# EasyEDA Pro project dub_siren_board.epro

# Schematic Schematic1
Board Name: master; Create Date: 2025-08-04; Page Name: P1; Project Name: dubsiren; Schematic Name: Schematic1; Update Date: 2025-09-22; Company: EasyEDA.com; Page Size: A4; Version: V1.0
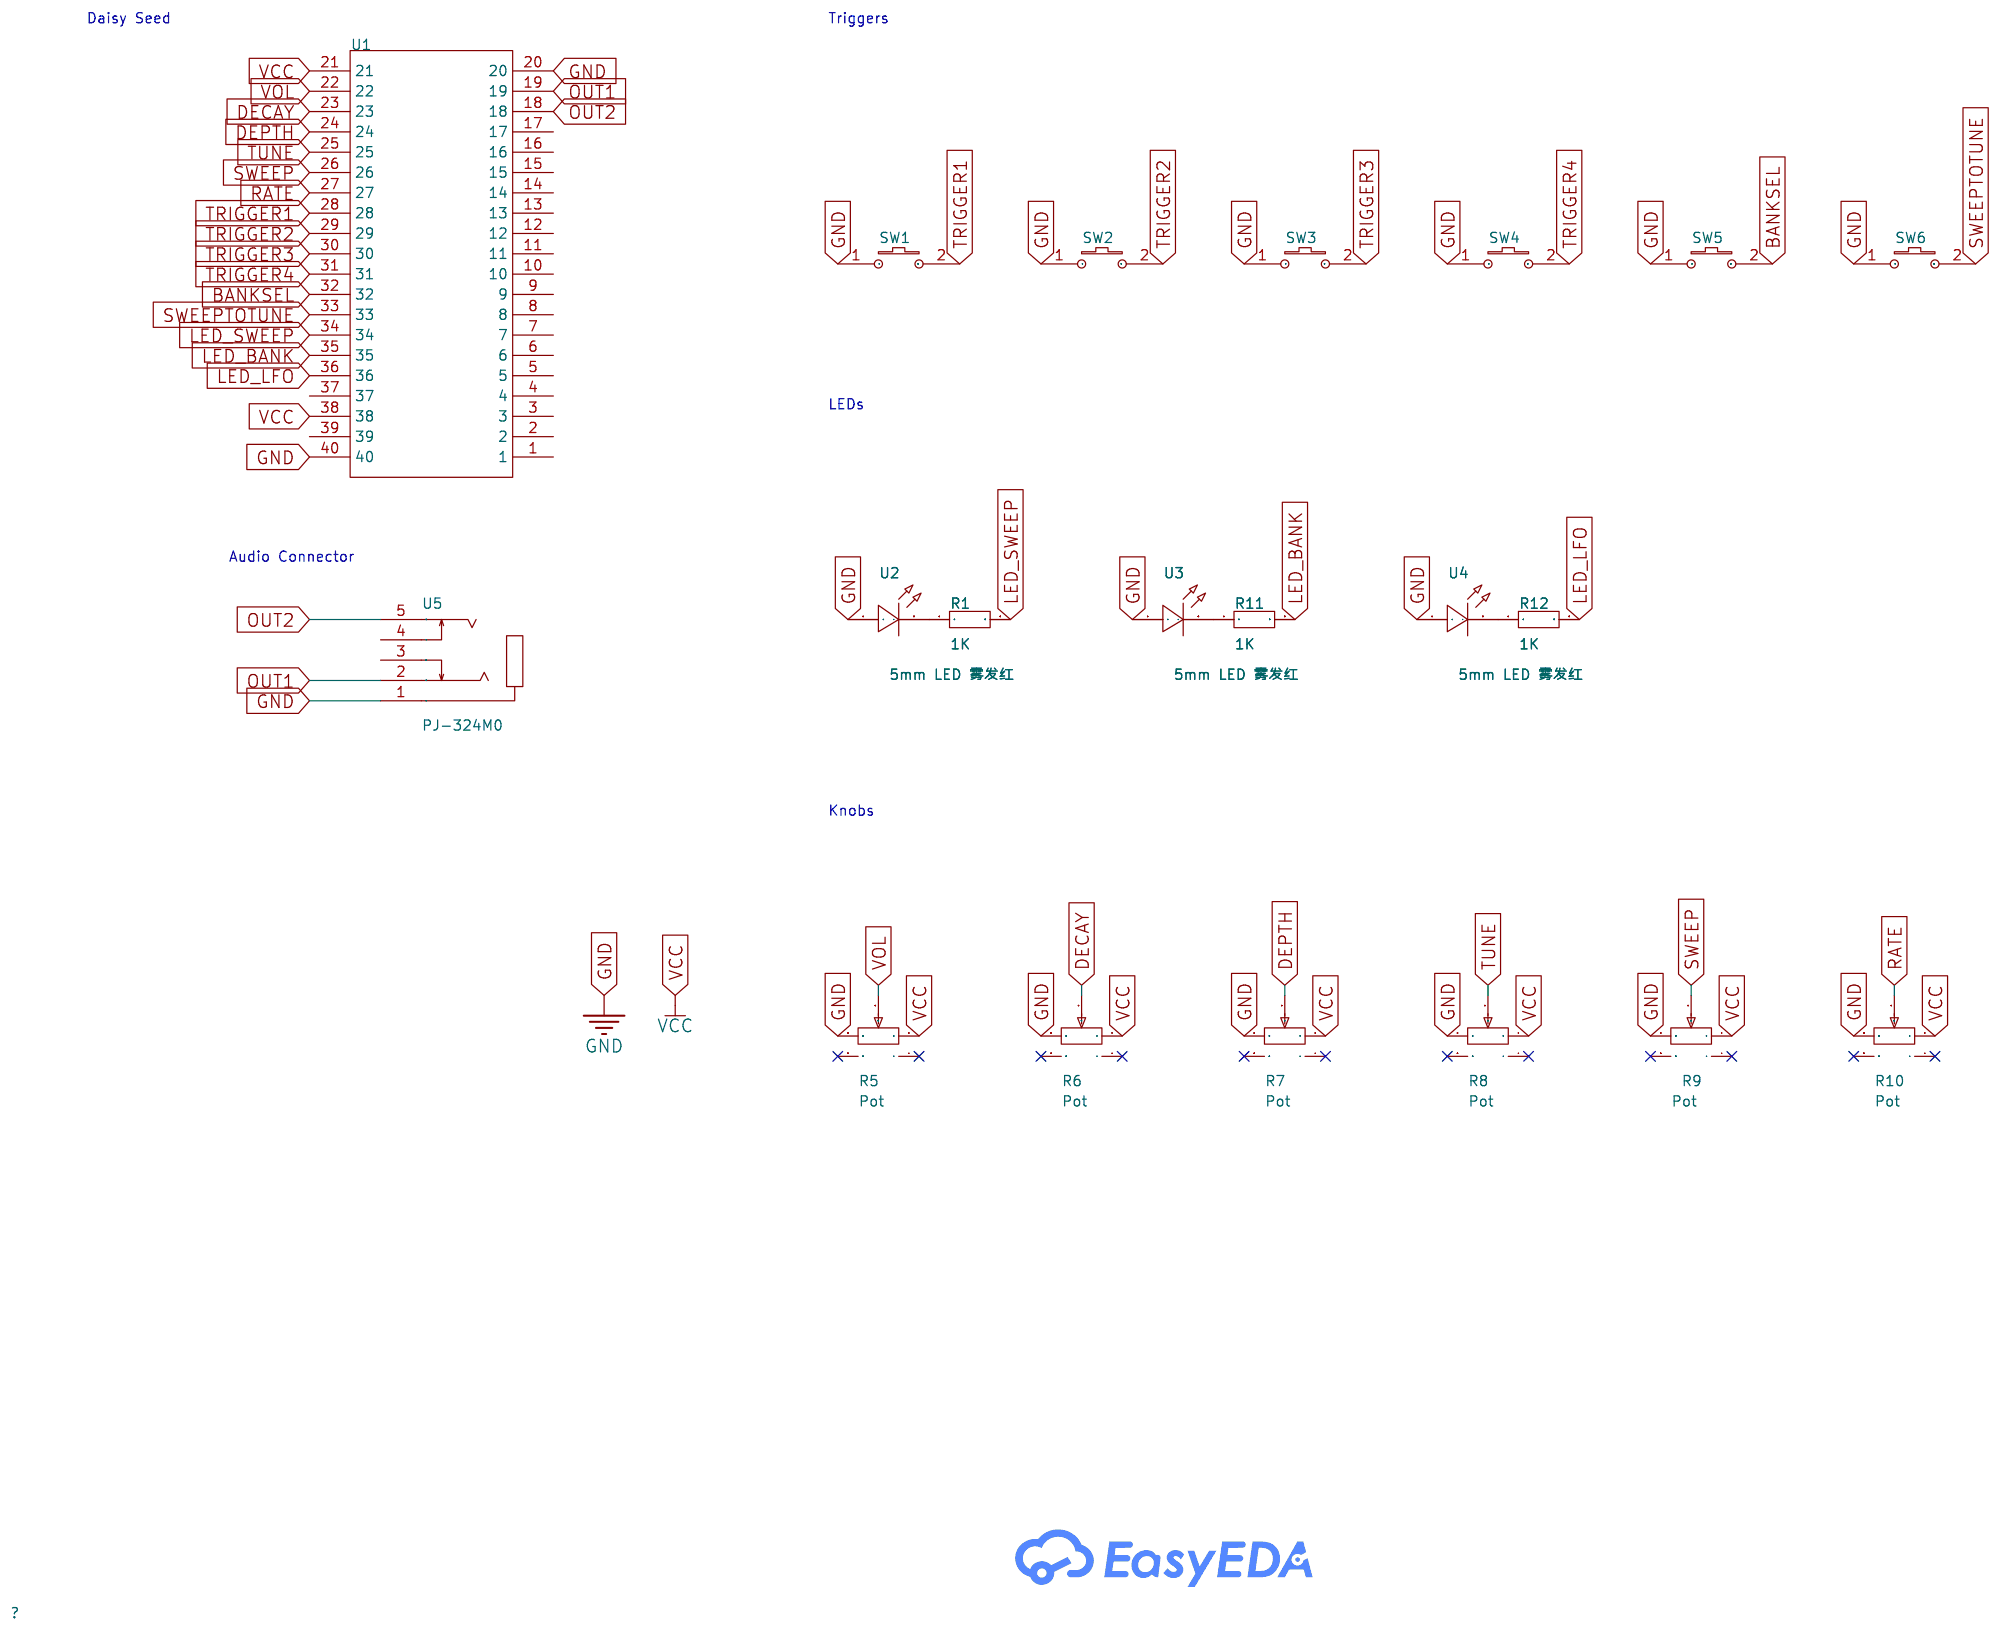
[diagram p0: schematic sheet]

## Parts
R1  1K  [R0603]
R5  Pot  [RES-ADJ-TH_RV09]
R6  Pot  [RES-ADJ-TH_RV09]
R7  Pot  [RES-ADJ-TH_RV09]
R8  Pot  [RES-ADJ-TH_RV09]
R9  Pot  [RES-ADJ-TH_RV09]
R10  Pot  [RES-ADJ-TH_RV09]
R11  1K  [R0603]
R12  1K  [R0603]
SW1  -  [SWITCH CHERRY MX]
SW2  -  [SWITCH CHERRY MX]
SW3  -  [SWITCH CHERRY MX]
SW4  -  [SWITCH CHERRY MX]
SW5  -  [SWITCH CHERRY MX]
SW6  -  [SWITCH CHERRY MX]
U1  -  [40 PinSocket]
U2  5mm LED 雾发红  [LED-TH_BD5.0-P2.54-FD]
U3  5mm LED 雾发红  [LED-TH_BD5.0-P2.54-FD]
U4  5mm LED 雾发红  [LED-TH_BD5.0-P2.54-FD]
U5  PJ-324M0  [AUDIO-TH_PJ-324-M]

## Library data of the parts
R1 R11 R12 = Res_0603: Supplier Footprint: 0603
R5-R10 = RV09AF-40-15K-B10K-0C: Supplier Part: C5151446; Supplier Footprint: 插件; JLCPCB Part Class: Extended Part; Supplier: LCSC
SW1-SW6 = Switch Cherry MX: Manufacturer: ZF; Manufacturer Part: MX1A-11NW; Supplier: RS-Online; Supplier Part: 664-575A
U1 = 40 PinSocket
U2-U4 = 5mm LED 雾发红: Supplier Part: C9900034380; Supplier Footprint: LED 5MM; JLCPCB Part Class: Extended Part; Supplier: LCSC
U5 = PJ-324M0: Connector Type:3.5mm Headphone Jack Current Rating:500mA Voltage Rating (Max):30V Operating Temperature:-20℃~+70℃ Operating Temperature:-20℃~+70℃; LCSC Part Name: 两件套 3.5mm耳机座; Supplier Part: C2884986; Manufacturer: XKB Connection(中国星坤); Supplier Footprint: 插件; JLCPCB Part Class: Extended Part; Datasheet: https://atta.szlcsc.com/upload/public/pdf/source/20211011/590F5910DCF166B8267C523E23F455F0.pdf; Supplier: LCSC; Connector Type: 3.5mm Headphone Jack; Current Rating: 500mA; Voltage Rating (Max): 30V; Operating Temperature: -20℃~+70℃

## Nets
GND: R5.3 R6.3 R7.3 R8.3 R9.3 R10.3 SW1.1 SW2.1 SW3.1 SW4.1 SW5.1 SW6.1 U1.20 U1.40 U2.1(+) U3.1(+) U4.1(+) U5.1
VCC: R5.1 R6.1 R7.1 R8.1 R9.1 R10.1 U1.21 U1.38
BANKSEL: SW5.2 U1.32
DECAY: R6.2 U1.23
DEPTH: R7.2 U1.24
LED_BANK: R11.2 U1.35
LED_LFO: R12.2 U1.36
LED_SWEEP: R1.2 U1.34
OUT1: U1.19 U5.2
OUT2: U1.18 U5.5
RATE: R10.2 U1.27
SWEEP: R9.2 U1.26
SWEEPTOTUNE: SW6.2 U1.33
TRIGGER1: SW1.2 U1.28
TRIGGER2: SW2.2 U1.29
TRIGGER3: SW3.2 U1.30
TRIGGER4: SW4.2 U1.31
TUNE: R8.2 U1.25
VOL: R5.2 U1.22
$1N1751: R1.1 U2.2(-)
$1N1843: R11.1 U3.2(-)
$1N1932: R12.1 U4.2(-)

Not connected (* = marked no-connect by the designer): R5 4* 5*; R6 4* 5*; R7 4* 5*; R8 4* 5*; R9 4* 5*; R10 4* 5*; U1 1 2 3 4 5 6 7 8 9 10 11 12 13 14 15 16 17 37 39; U5 3 4

## Notes on the sheet
- Daisy Seed
- Triggers
- LEDs
- Audio Connector
- Knobs

# Board PCB1
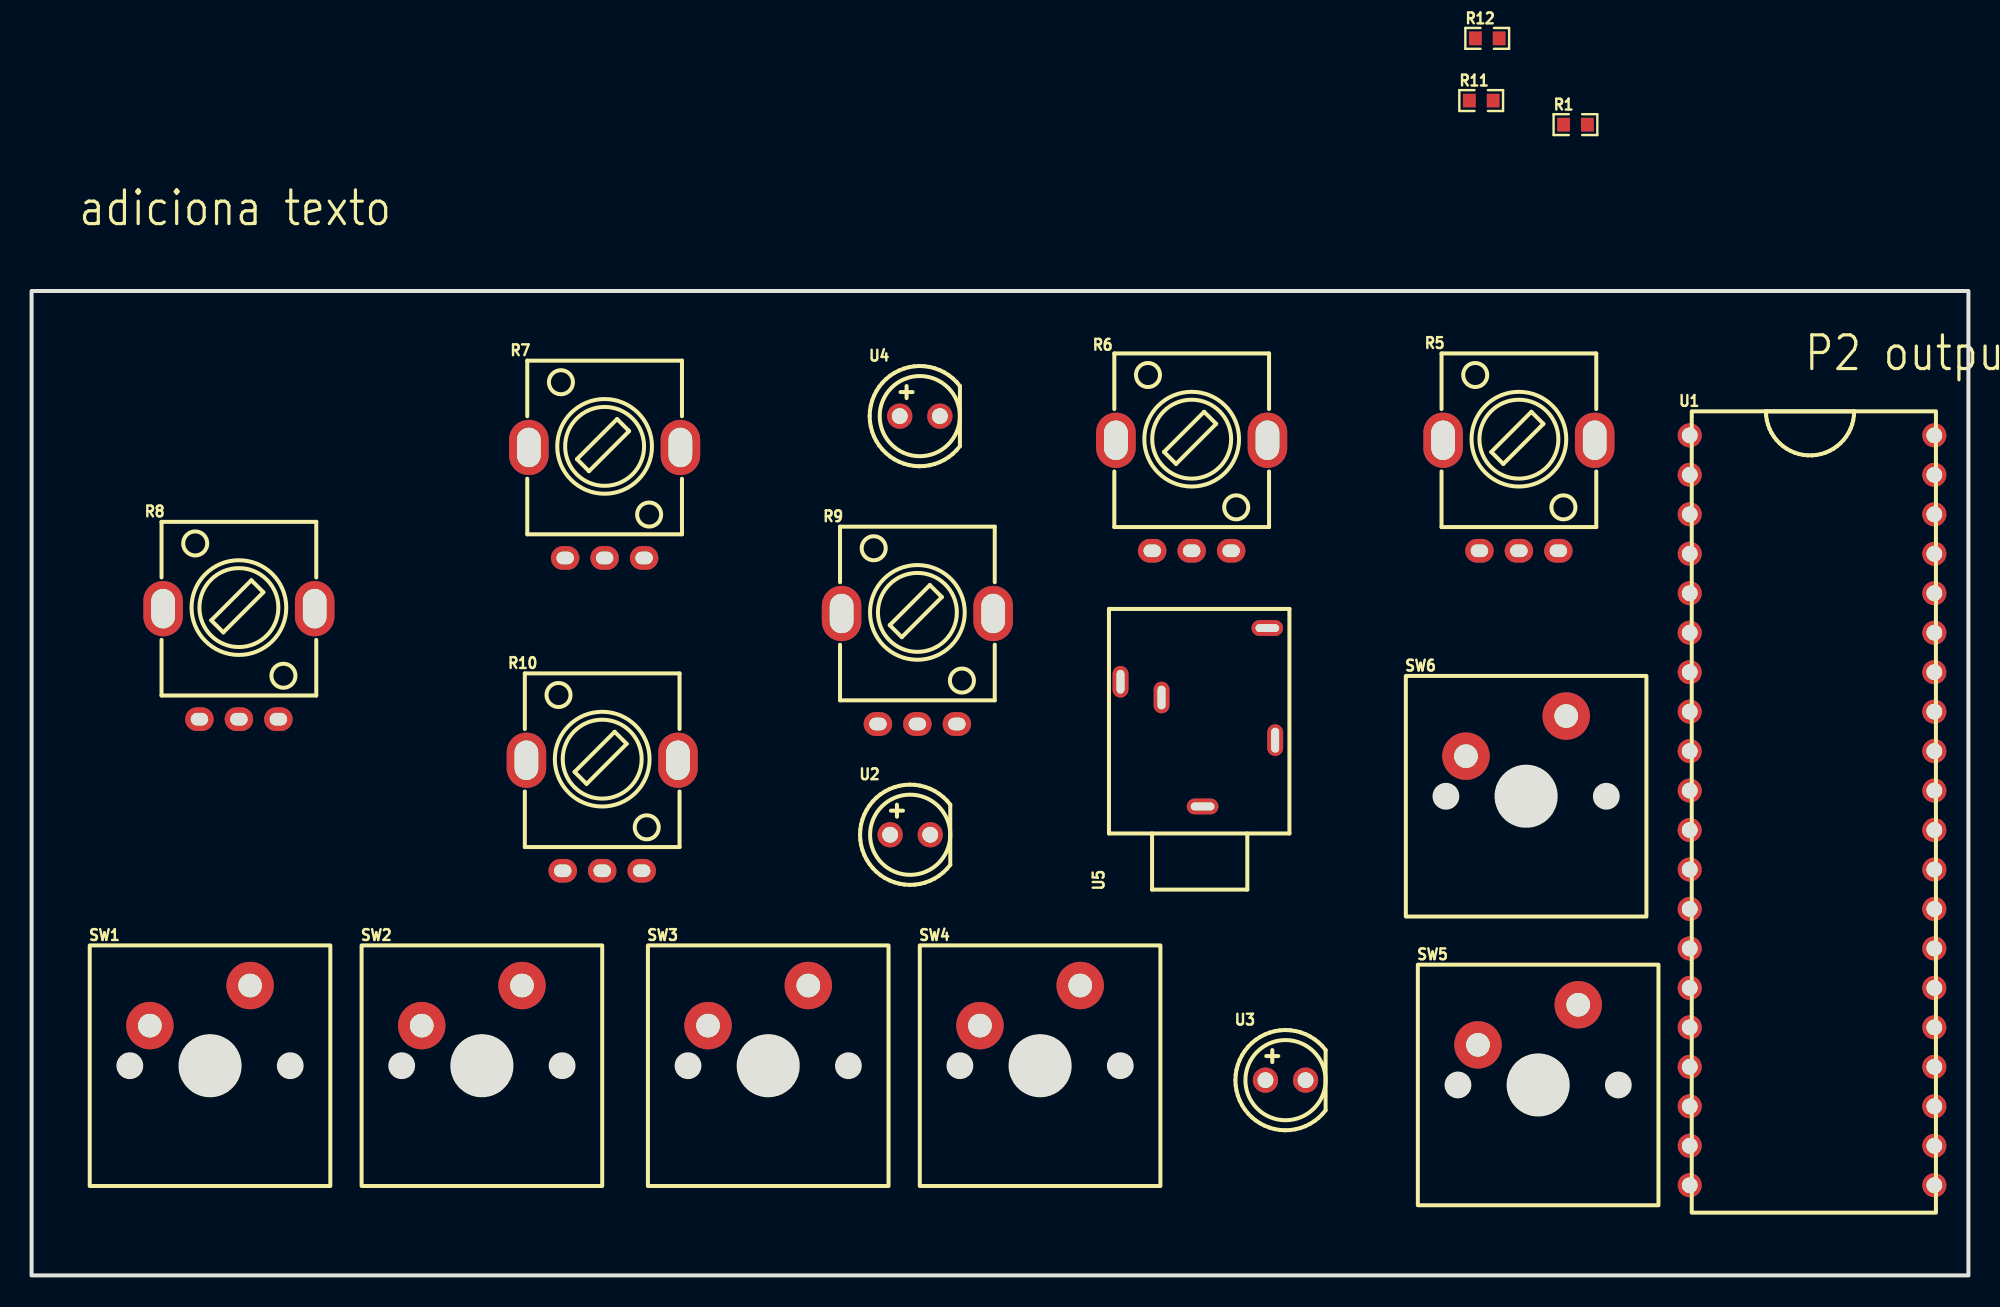
[diagram p1: board, top side]
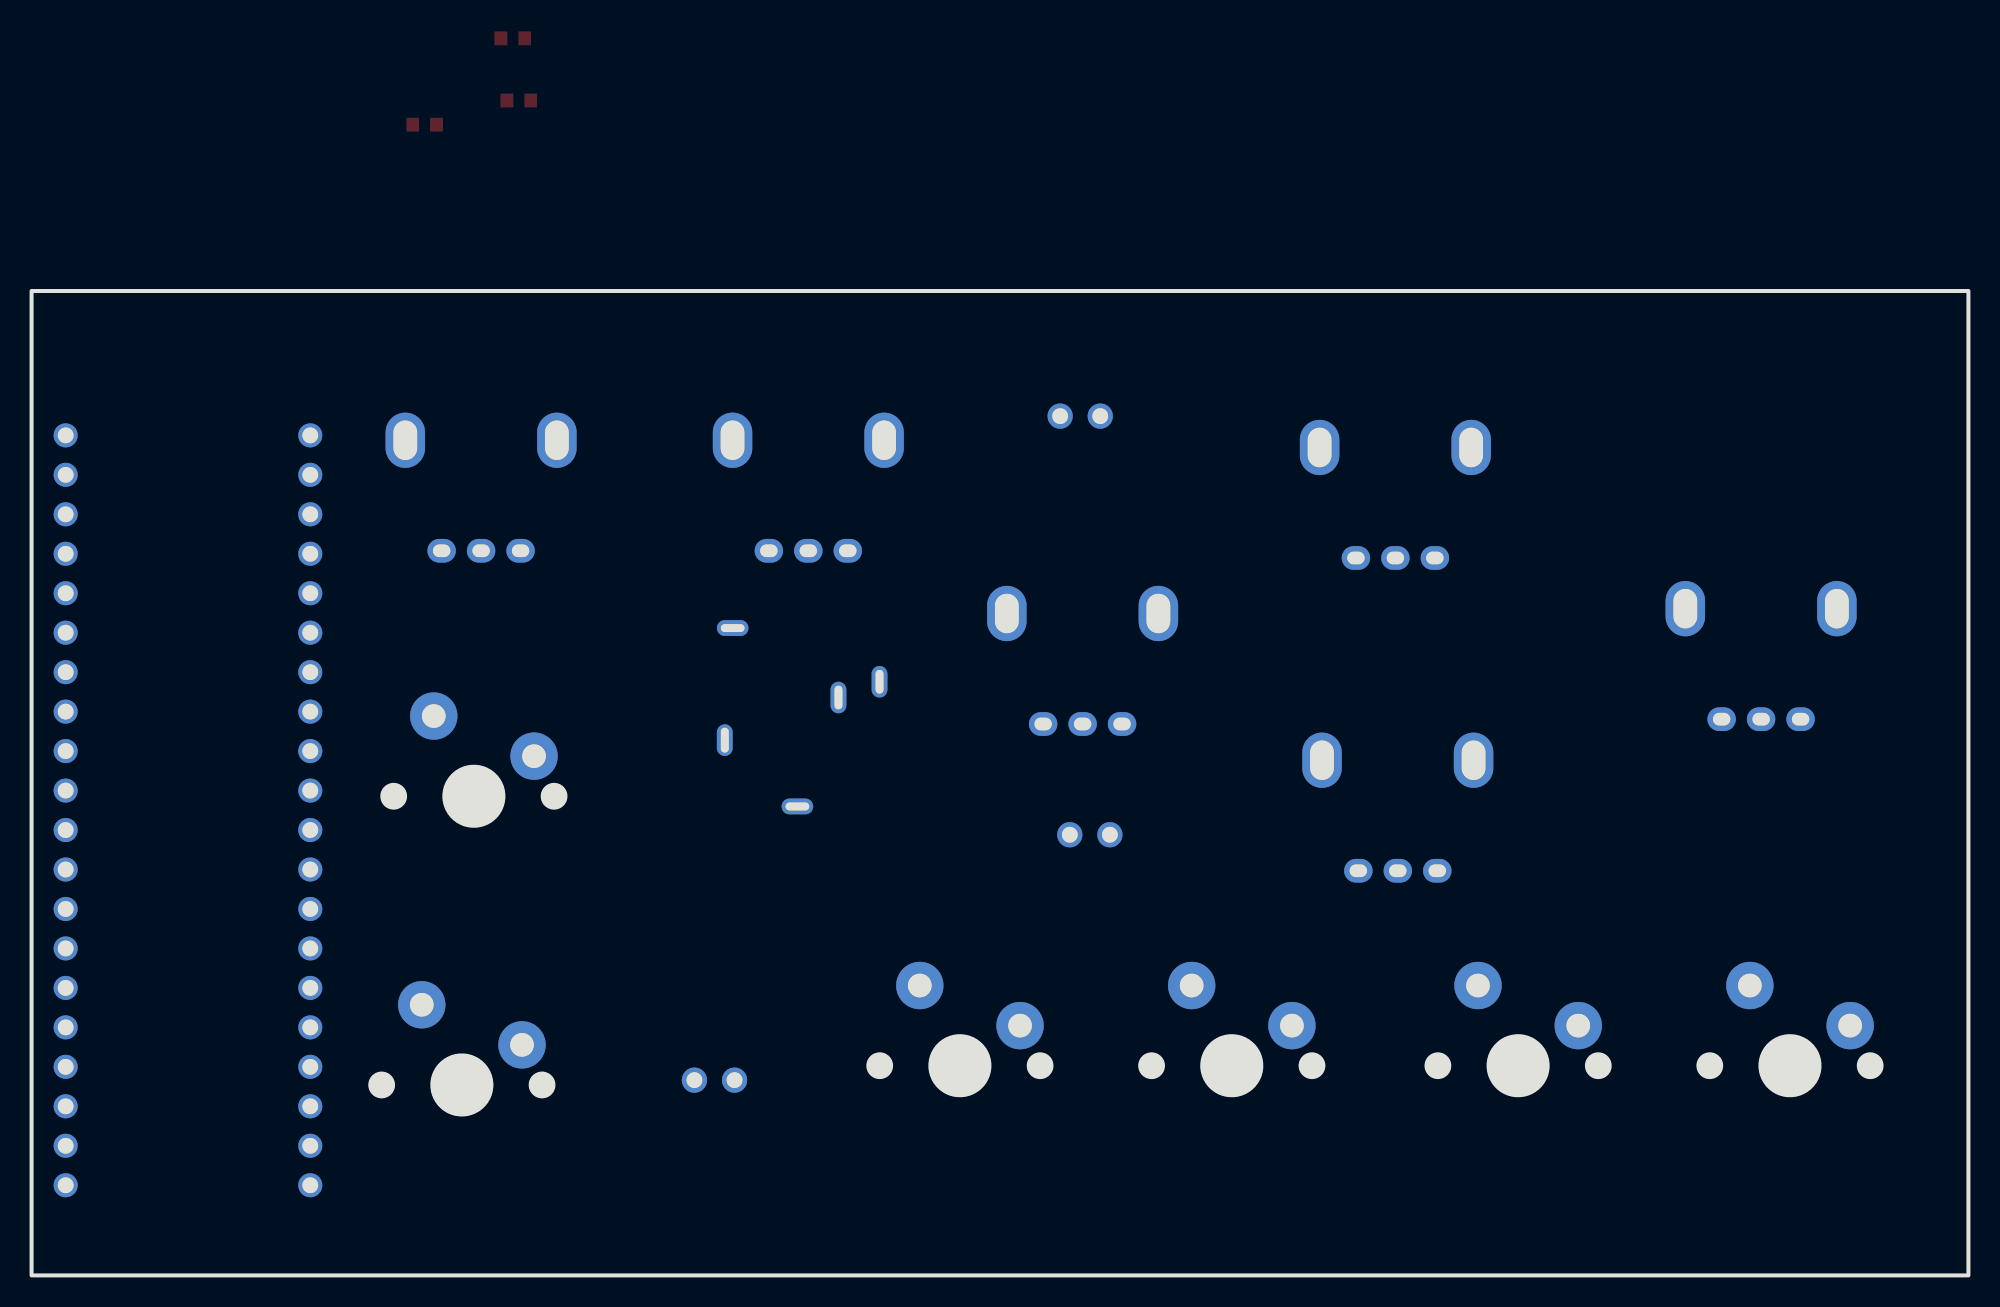
[diagram p2: board, bottom side, seen from below]

Outline 122.68 x 62.36 mm; copper layers: Top Layer, Bottom Layer. Coordinates in mm from the lower left corner of the outline.
Outline path: rectangle 0,62.36 122.68,0
Stack: Top Layer 0.035mm / Dielectric1 1.51mm FR4 er 4.5 / Bottom Layer 0.035mm

## Design rules (mm)
template: JLCPCB Capability(Two Layers Board)
spacing copperThickness1oz (default): track to track 0.102, other pairs 0.152 to 0.3
spacing copperThickness2oz: track to track 0.203, other pairs 0.152 to 0.3
track width copperThickness1oz (default): min 0.127, default 0.254, max 2.54
track width copperThickness2oz: min 0.203, default 0.254, max 2.54
differential pair differentialPair (default): width min 0.127, default 0.254, max 2.54; gap min 0.152, default 0.152
via viaSize (default): diameter min 0.5, default 0.61, max 10; hole min 0.3, default 0.305, max 6.3

## Placement (name value [footprint] x y rotation side)
R1  1K  [R0603]  97.79 72.9 0 top
R5  Pot  [RES-ADJ-TH_RV09]  94.21 49.4 0 top
R6  Pot  [RES-ADJ-TH_RV09]  73.48 49.4 0 top
R7  Pot  [RES-ADJ-TH_RV09]  36.3 48.95 0 top
R8  Pot  [RES-ADJ-TH_RV09]  13.13 38.73 0 top
R9  Pot  [RES-ADJ-TH_RV09]  56.11 38.43 0 top
R10  Pot  [RES-ADJ-TH_RV09]  36.14 29.13 0 top
R11  1K  [R0603]  91.82 74.42 0 top
R12  1K  [R0603]  92.2 78.36 0 top
SW1  -  [SWITCH CHERRY MX]  11.3 13.28 0 top
SW2  -  [SWITCH CHERRY MX]  28.52 13.28 0 top
SW3  -  [SWITCH CHERRY MX]  46.66 13.28 0 top
SW4  -  [SWITCH CHERRY MX]  63.88 13.28 0 top
SW5  -  [SWITCH CHERRY MX]  95.43 12.06 0 top
SW6  -  [SWITCH CHERRY MX]  94.67 30.35 0 top
U1  -  [40 PinSocket]  105.03 54.74 0 top
U2  5mm LED 雾发红  [LED-TH_BD5.0-P2.54-FD]  55.65 27.91 0 top
U3  5mm LED 雾发红  [LED-TH_BD5.0-P2.54-FD]  79.43 12.37 0 top
U4  5mm LED 雾发红  [LED-TH_BD5.0-P2.54-FD]  56.26 54.43 0 top
U5  PJ-324M0  [AUDIO-TH_PJ-324-M]  73.87 35.36 90 top

## Footprints (pads in the part's own frame, mm; a bottom-side part is the same pattern mirrored in y, then rotated)
40 PinSocket
  round 1.524 hole 1: 1(0,-1.524) 2(0,-4.024) 3(0,-6.524) 4(0,-9.024) 5(0,-11.524) 6(0,-14.024) 7(0,-16.524) 8(0,-19.024) 9(0,-21.524) 10(0,-24.024) 11(0,-26.524) 12(0,-29.024) 13(0,-31.524) 14(0,-34.024) 15(0,-36.524) 16(0,-39.024) 17(0,-41.524) 18(0,-44.024) 19(0,-46.524) 20(0,-49.024) 21(15.494,-49.024) 22(15.494,-46.524) 23(15.494,-44.024) 24(15.494,-41.524) 25(15.494,-39.024) 26(15.494,-36.524) 27(15.494,-34.024) 28(15.494,-31.524) 29(15.494,-29.024) 30(15.494,-26.524) 31(15.494,-24.024) 32(15.494,-21.524) 33(15.494,-19.024) 34(15.494,-16.524) 35(15.494,-14.024) 36(15.494,-11.524) 37(15.494,-9.024) 38(15.494,-6.524) 39(15.494,-4.024) 40(15.494,-1.524)
AUDIO-TH_PJ-324-M
  oval 1x2 hole 0.5x1.5: 1(-5.65,-0.3) 4(5.65,-4.4)
  oval 2x1 hole 1.5x0.5: 2(2.25,4.9) 3(1.25,2.3)
  oval 2x1 hole 1.575x0.5: 5(-1.45,-4.9)
LED-TH_BD5.0-P2.54-FD
  round 1.6 hole 1: 1(-1.27,0) 2(1.27,0)
R0603
  rect 0.806x0.864 smd: 1(-0.753,0) 2(0.753,0)
RES-ADJ-TH_RV09
  oval 1.8x1.5 hole 1.1x0.8: 1(-2.5,-3.5) 2(0,-3.5) 3(2.5,-3.5)
  oval 2.5x3.5 hole 1.5x2.5: 4(4.8,3.5) 5(-4.8,3.5)
SWITCH CHERRY MX
  round 3 hole 1.5: 1(-3.81,2.54) 2(2.54,5.08)

## Nets
As in the schematic.

Pads without a net: R5 4 5; R6 4 5; R7 4 5; R8 4 5; R9 4 5; R10 4 5; U1 1 2 3 4 5 6 7 8 9 10 11 12 13 14 15 16 17 37 39; U5 3 4

## Text on the board
Top Silkscreen Layer: adiciona texto | P2 output
